# EAGLE design TestBench_rev4 (EAGLE 6.3)
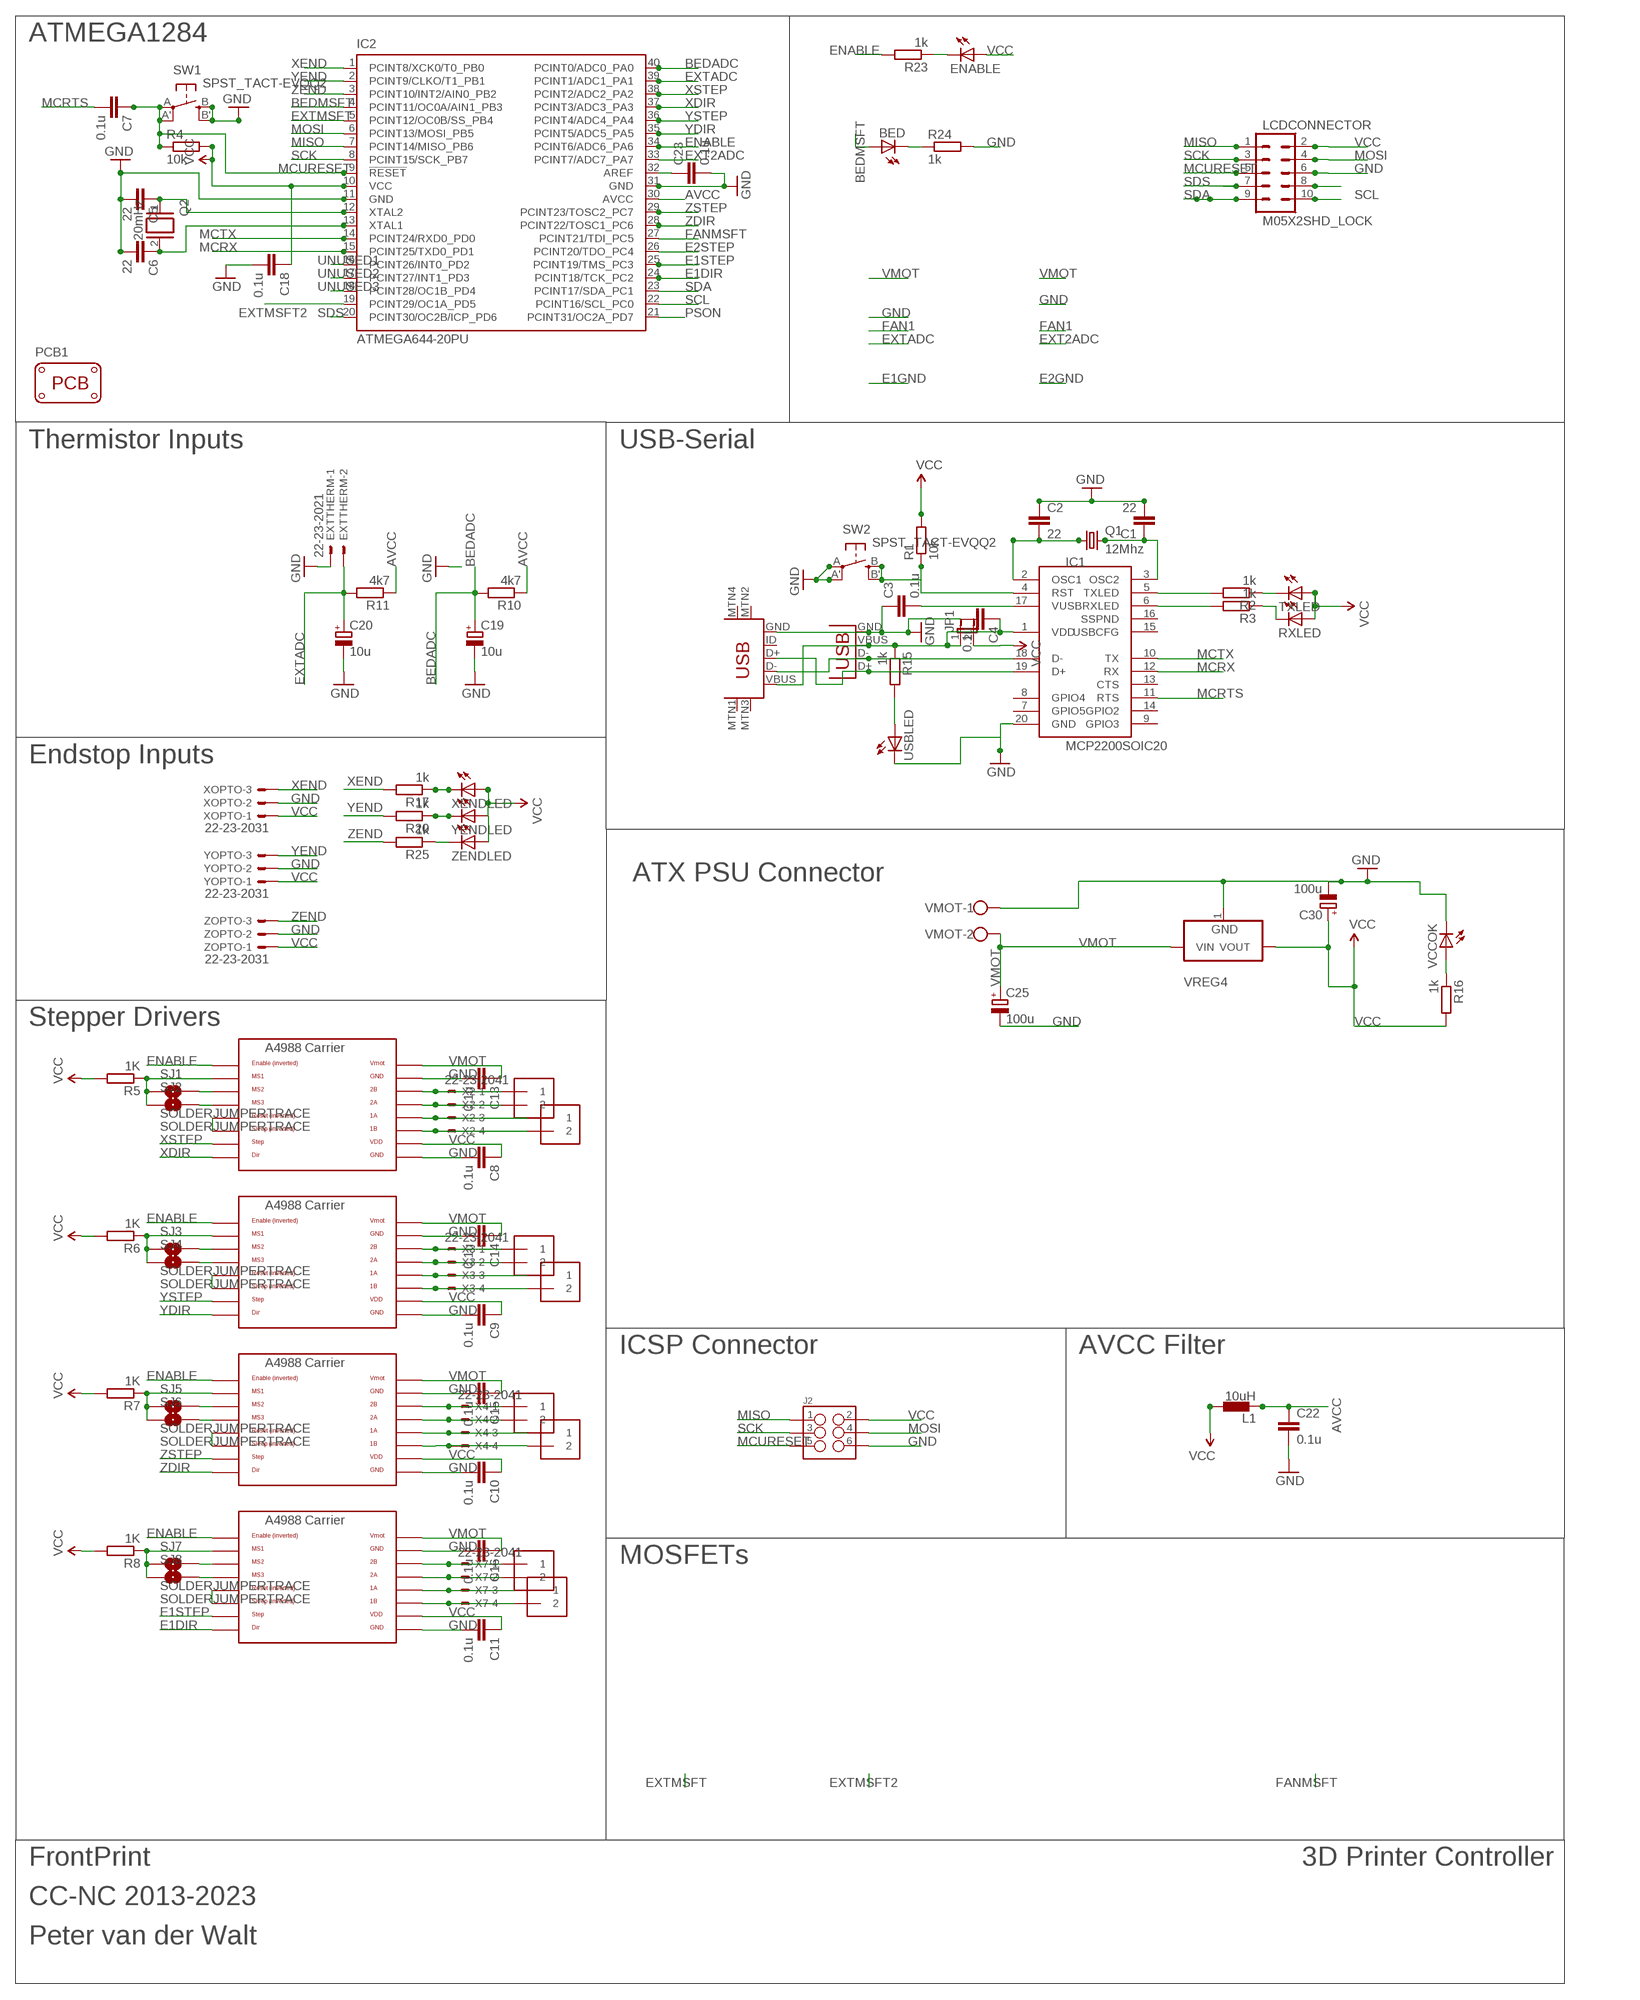
[diagram p0: schematic, sheet 1]

## Parts
BED  LEDSMT1206  [1206]
C1  22  CAP1206  [1206]
C2  22  CAP1206  [1206]
C3  0.1u  CAP1206  [1206]
C4  0.1u  CAP1206  [1206]
C5  22  CAP1206  [1206]
C6  22  CAP1206  [1206]
C7  0.1u  CAP1206  [1206]
C8  0.1u  CAP1206  [1206]
C9  0.1u  CAP1206  [1206]
C10  0.1u  CAP1206  [1206]
C11  0.1u  CAP1206  [1206]
C13  0.1u  CAP1206  [1206]
C14  0.1u  CAP1206  [1206]
C15  0.1u  CAP1206  [1206]
C16  0.1u  CAP1206  [1206]
C18  0.1u  CAP1206  [1206]
C19  10u  CPOL-EUE2.5-5  [E2,5-5]
C20  10u  CPOL-EUE2.5-5  [E2,5-5]
C22  0.1u  CAP1206  [1206]
C23  0.1u  CAP1206  [1206]
C25  100u  CPOL-EUE5-8.5  [E5-8,5]
C30  100u  CPOL-EUE5-8.5  [E5-8,5]
E1MOT1  1X2-3.5MM  [3.5MMTERM]
E1MOT2  1X2-3.5MM  [3.5MMTERM]
ENABLE  LEDSMT1206  [1206]
EPOLOLU  POLOLU_A4983CARRIER  [A4988BREAKOUT]
EXTTHERM  22-23-2021  [22-23-2021]
IC1  MCP2200SOIC20  [SOIC20]
IC2  ATMEGA644-20PU  [DIL40]
J2  M03X2  [2X3-SHROUDED]
JP1  JUMPER-2PTH_LOCK  [1X02_LOCK]
L1  10uH  BL01RN1A  [BL01RN1A]
LCDCONNECTOR  M05X2SHD_LOCK  [2X5-SHROUDED_LOCK]
PCB1  PCB_DP_SQUARE-10X10  [DP100100_V1]
Q1  12Mhz  CRYSTALHC49UP  [HC49UP]
Q2  20mHz  XTAL/S  [QS]
R1  10k  R-EU_M1206  [M1206]
R2  1k  R-EU_M1206  [M1206]
R3  1k  R-EU_M1206  [M1206]
R4  10k  R-EU_M1206  [M1206]
R5  1K  R-EU_M1206  [M1206]
R6  1K  R-EU_M1206  [M1206]
R7  1K  R-EU_M1206  [M1206]
R8  1K  R-EU_M1206  [M1206]
R10  4k7  R-EU_M1206  [M1206]
R11  4k7  R-EU_M1206  [M1206]
R15  1k  R-EU_M1206  [M1206]
R16  1k  R-EU_M1206  [M1206]
R17  1k  R-EU_M1206  [M1206]
R20  1k  R-EU_M1206  [M1206]
R23  1k  R-EU_M1206  [M1206]
R24  1k  R-EU_M1206  [M1206]
R25  1k  R-EU_M1206  [M1206]
RXLED  LEDSMT1206  [1206]
SJ1  SOLDERJUMPERTRACE  [SJ_2S-TRACE]
SJ2  SOLDERJUMPERTRACE  [SJ_2S-TRACE]
SJ3  SOLDERJUMPERTRACE  [SJ_2S-TRACE]
SJ4  SOLDERJUMPERTRACE  [SJ_2S-TRACE]
SJ5  SOLDERJUMPERTRACE  [SJ_2S-TRACE]
SJ6  SOLDERJUMPERTRACE  [SJ_2S-TRACE]
SJ7  SOLDERJUMPERTRACE  [SJ_2S-TRACE]
SJ8  SOLDERJUMPERTRACE  [SJ_2S-TRACE]
SW1  SPST_TACT-EVQQ2  [EVQ-Q2]
SW2  SPST_TACT-EVQQ2  [EVQ-Q2]
TXLED  LEDSMT1206  [1206]
U$2  USB-MINIB-5PIN  [USB-MINIB]
USBLED  LEDSMT1206  [1206]
VCCOK  LEDSMT1206  [1206]
VMOT  W237-102  [W237-102]
VREG4  VREG_3PINS-DPAK  [DPAK]
X1  USBPTH  [USB-B-PTH]
X2  22-23-2041  [22-23-2041]
X3  22-23-2041  [22-23-2041]
X4  22-23-2041  [22-23-2041]
X7  22-23-2041  [22-23-2041]
XENDLED  LEDSMT1206  [1206]
XMOT1  1X2-3.5MM  [3.5MMTERM]
XMOT2  1X2-3.5MM  [3.5MMTERM]
XOPTO  22-23-2031  [22-23-2031]
XPOLOLU  POLOLU_A4983CARRIER  [A4988BREAKOUT]
YENDLED  LEDSMT1206  [1206]
YMOT1  1X2-3.5MM  [3.5MMTERM]
YMOT2  1X2-3.5MM  [3.5MMTERM]
YOPTO  22-23-2031  [22-23-2031]
YPOLOLU  POLOLU_A4983CARRIER  [A4988BREAKOUT]
ZENDLED  LEDSMT1206  [1206]
ZMOT1  1X2-3.5MM  [3.5MMTERM]
ZMOT2  1X2-3.5MM  [3.5MMTERM]
ZOPTO  22-23-2031  [22-23-2031]
ZPOLOLU  POLOLU_A4983CARRIER  [A4988BREAKOUT]

## Nets
AVCC: C22.1 IC2.30(AVCC) L1.1 R10.1 R11.1
BEDADC: C19.+ IC2.40(PCINT0/ADC0_PA0) R10.2
BEDMSFT: BED.A IC2.4(PCINT11/OC0A/AIN1_PB3)
E1DIR: EPOLOLU.DIR IC2.24(PCINT18/TCK_PC2)
E1STEP: EPOLOLU.STEP IC2.25(PCINT19/TMS_PC3)
E2STEP: IC2.26(PCINT20/TDO_PC4)
E11A: E1MOT2.1 EPOLOLU.1A X7.3
E11B: E1MOT2.2 EPOLOLU.1B X7.4
E12A: E1MOT1.2 EPOLOLU.2A X7.2
E12B: E1MOT1.1 EPOLOLU.2B X7.1
ENABLE: EPOLOLU.EN IC2.34(PCINT6/ADC6_PA6) R23.2 XPOLOLU.EN YPOLOLU.EN ZPOLOLU.EN
EXT2ADC: IC2.33(PCINT7/ADC7_PA7)
EXTADC: C20.+ EXTTHERM.2 IC2.39(PCINT1/ADC1_PA1) R11.2
EXTMSFT: IC2.5(PCINT12/OC0B/SS_PB4)
EXTMSFT2: IC2.19(PCINT29/OC1A_PD5)
FANMSFT: IC2.27(PCINT21/TDI_PC5)
GND: C1.2 C2.1 C3.1 C4.2 C5.2 C6.2 C8.2 C9.2 C10.2 C11.2 C13.2 C14.2 C15.2 C16.2 C18.2 C19.- C20.- C22.2 C23.2 C25.- C30.- EPOLOLU.GND EPOLOLU.GND@0(GND) EXTTHERM.1 IC1.20(GND) IC2.11(GND) IC2.31(GND) J2.6 LCDCONNECTOR.6 R24.2 SW1.B'(S1) SW1.B(S) SW2.A'(P1) SW2.A(P) U$2.GND USBLED.C VCCOK.C VMOT.1 VREG4.1(GND) X1.GND XOPTO.2 XPOLOLU.GND XPOLOLU.GND@0(GND) YOPTO.2 YPOLOLU.GND YPOLOLU.GND@0(GND) ZOPTO.2 ZPOLOLU.GND ZPOLOLU.GND@0(GND)
MCRTS: C7.2 IC1.11(RTS)
MCRX: IC1.12(RX) IC2.15(PCINT25/TXD0_PD1)
MCTX: IC1.10(TX) IC2.14(PCINT24/RXD0_PD0)
MCURESET: C7.1 IC2.9(!RESET) J2.5 LCDCONNECTOR.5 R4.1 SW1.A'(P1) SW1.A(P)
MISO: IC2.7(PCINT14/MISO_PB6) J2.1 LCDCONNECTOR.1
MOSI: IC2.6(PCINT13/MOSI_PB5) J2.4 LCDCONNECTOR.4
N$1: C2.2 IC1.2(OSC1) Q1.1
N$2: C1.1 IC1.3(OSC2) Q1.2
N$3: IC1.5(TXLED) R2.2
N$4: IC1.18(D-) U$2.D- X1.D-
N$5: IC1.19(D+) U$2.D+ X1.D+
N$6: IC1.6(RXLED) R3.2
N$7: C3.2 IC1.17(VUSB)
N$9: R2.1 TXLED.C
N$10: R3.1 RXLED.C
N$11: C5.1 IC2.12(XTAL2) Q2.1
N$12: C6.1 IC2.13(XTAL1) Q2.2
N$13: IC1.4(RST) R1.1 SW2.B'(S1) SW2.B(S)
N$14: R7.1 SJ5.1 SJ6.1 ZPOLOLU.MS1
N$15: SJ6.2 ZPOLOLU.MS3
N$16: SJ5.2 ZPOLOLU.MS2
N$17: EPOLOLU.MS2 SJ7.2
N$18: EPOLOLU.MS3 SJ8.2
N$19: EPOLOLU.MS1 R8.1 SJ7.1 SJ8.1
N$20: SJ3.2 YPOLOLU.MS2
N$21: SJ4.2 YPOLOLU.MS3
N$22: R6.1 SJ3.1 SJ4.1 YPOLOLU.MS1
N$23: SJ1.2 XPOLOLU.MS2
N$24: SJ2.2 XPOLOLU.MS3
N$25: R5.1 SJ1.1 SJ2.1 XPOLOLU.MS1
N$26: XPOLOLU.RST XPOLOLU.SLP(SLEEP)
N$27: YPOLOLU.RST YPOLOLU.SLP(SLEEP)
N$28: ZPOLOLU.RST ZPOLOLU.SLP(SLEEP)
N$29: EPOLOLU.RST EPOLOLU.SLP(SLEEP)
N$34: X4.4 ZMOT2.2 ZPOLOLU.1B
N$35: X4.3 ZMOT2.1 ZPOLOLU.1A
N$36: X4.2 ZMOT1.2 ZPOLOLU.2A
N$37: X4.1 ZMOT1.1 ZPOLOLU.2B
N$38: X3.4 YMOT2.2 YPOLOLU.1B
N$39: X3.3 YMOT2.1 YPOLOLU.1A
N$40: X3.2 YMOT1.2 YPOLOLU.2A
N$41: X3.1 YMOT1.1 YPOLOLU.2B
N$42: X2.4 XMOT2.2 XPOLOLU.1B
N$43: X2.3 XMOT2.1 XPOLOLU.1A
N$44: X2.2 XMOT1.2 XPOLOLU.2A
N$45: X2.1 XMOT1.1 XPOLOLU.2B
N$54: C23.1 IC2.32(AREF)
N$57: R17.1 XENDLED.C
N$58: C4.1 IC1.1(VDD) JP1.1 R15.1 U$2.VBUS X1.VBUS
N$59: BED.C R24.1
N$60: R20.1 YENDLED.C
N$62: R25.1 ZENDLED.C
N$64: R16.1 VCCOK.A
N$68: R15.2 USBLED.A
N$71: ENABLE.C R23.1
N$73: LCDCONNECTOR.8
PSON: IC2.21(PCINT31/OC2A_PD7)
SCK: IC2.8(PCINT15/SCK_PB7) J2.3 LCDCONNECTOR.3
SCL: IC2.22(PCINT16/SCL_PC0) LCDCONNECTOR.10
SDA: IC2.23(PCINT17/SDA_PC1) LCDCONNECTOR.9
SDS: IC2.20(PCINT30/OC2B/ICP_PD6) LCDCONNECTOR.7
UNUSED1: IC2.16(PCINT26/INT0_PD2)
UNUSED2: IC2.17(PCINT27/INT1_PD3)
UNUSED3: IC2.18(PCINT28/OC1B_PD4)
VCC: C8.1 C9.1 C10.1 C11.1 C18.1 C30.+ ENABLE.A EPOLOLU.VDD IC2.10(VCC) J2.2 JP1.2 L1.2 LCDCONNECTOR.2 R1.2 R4.2 R5.2 R6.2 R7.2 R8.2 R16.2 RXLED.A TXLED.A VREG4.2(VOUT) XENDLED.A XOPTO.1 XPOLOLU.VDD YENDLED.A YOPTO.1 YPOLOLU.VDD ZENDLED.A ZOPTO.1 ZPOLOLU.VDD
VMOT: C13.1 C14.1 C15.1 C16.1 C25.+ EPOLOLU.VMOT VMOT.2 VREG4.3(VIN) XPOLOLU.VMOT YPOLOLU.VMOT ZPOLOLU.VMOT
XDIR: IC2.37(PCINT3/ADC3_PA3) XPOLOLU.DIR
XEND: IC2.1(PCINT8/XCK0/T0_PB0) R17.2 XOPTO.3
XSTEP: IC2.38(PCINT2/ADC2_PA2) XPOLOLU.STEP
YDIR: IC2.35(PCINT5/ADC5_PA5) YPOLOLU.DIR
YEND: IC2.2(PCINT9/CLKO/T1_PB1) R20.2 YOPTO.3
YSTEP: IC2.36(PCINT4/ADC4_PA4) YPOLOLU.STEP
ZDIR: IC2.28(PCINT22/TOSC1_PC6) ZPOLOLU.DIR
ZEND: IC2.3(PCINT10/INT2/AIN0_PB2) R25.2 ZOPTO.3
ZSTEP: IC2.29(PCINT23/TOSC2_PC7) ZPOLOLU.STEP
Unconnected: IC1.7(GPIO5) IC1.8(GPIO4) IC1.9(GPIO3) IC1.13(CTS) IC1.14(GPIO2) IC1.15(USBCFG) IC1.16(SSPND) U$2.ID U$2.MTN1(MTN2) U$2.MTN2(MTN3) U$2.MTN3(MTN1) U$2.MTN4

## Notes on the sheet
- ATMEGA1284
- Thermistor Inputs | USB-Serial
- Endstop Inputs
- ATX PSU Connector
- Stepper Drivers
- ICSP Connector | AVCC Filter
- MOSFETs
- FrontPrint | 3D Printer Controller
- CC-NC 2013-2023
- Peter van der Walt

## Library data of the parts
BED ENABLE RXLED TXLED USBLED VCCOK XENDLED YENDLED ZENDLED = led:LED: LED OSRAM: - CHIPLED LG R971, LG N971, LY N971, LG Q971, LY Q971, LO R971, LY R971 LH N974, LH R974 LS Q976, LO Q976, LY Q976 LO Q996 - Hyper CHIPLED LW Q18S LB Q993, LB Q99A, LB R99A - SideLED LS A670, LO A670, LY A670, LG A670, LP A670 LB A673, LV A673, LT A673, LW A673 LH A674 LY A675 LS A676, LA A676, LO A676, LY A676, LW A676 LS A679, LY A679, LG A679 - Hyper Micro SIDELED® LS Y876, LA Y876, LO Y876, LY Y876 LT Y87S - SmartLED LW L88C, LW L88S LB L89C, LB L89S, LG L890 LS L89K, LO L89K, LY L89K LS L896, LA L896, LO L896, LY L896 - TOPLED LS T670, LO T670, LY T670, LG T670, LP T670 LSG T670, LSP T670, LSY T670, LOP T670, LYG T670 LG T671, LOG T671, LSG T671 LB T673, LV T673, LT T673, LW T673 LH T674 LS T676, LA T676, LO T676, LY T676, LB T676, LH T676, LSB T676, LW T676 LB T67C, LV T67C, LT T67C, LS T67K, LO T67K, LY T67K, LW E67C LS E67B, LA E67B, LO E67B, LY E67B, LB E67C, LV E67C, LT E67C LW T67C LS T679, LY T679, LG T679 LS T770, LO T770, LY T770, LG T770, LP T770 LB T773, LV T773, LT T773, LW T773 LH T774 LS E675, LA E675, LY E675, LS T675 LS T776, LA T776, LO T776, LY T776, LB T776 LHGB T686 LT T68C, LB T68C - Hyper Mini TOPLED® LB M676 - Mini TOPLED Santana® LG M470 LS M47K, LO M47K, LY M47K Source: http://www.osram.convergy.de LUXEON: - LUMILED® LXK2-PW12-R00, LXK2-PW12-S00, LXK2-PW14-U00, LXK2-PW14-V00 LXK2-PM12-R00, LXK2-PM12-S00, LXK2-PM14-U00 LXK2-PE12-Q00, LXK2-PE12-R00, LXK2-PE12-S00, LXK2-PE14-T00, LXK2-PE14-U00 LXK2-PB12-K00, LXK2-PB12-L00, LXK2-PB12-M00, LXK2-PB14-N00, LXK2-PB14-P00, LXK2-PB14-Q00 LXK2-PR12-L00, LXK2-PR12-M00, LXK2-PR14-Q00, LXK2-PR14-R00 LXK2-PD12-Q00, LXK2-PD12-R00, LXK2-PD12-S00 LXK2-PH12-R00, LXK2-PH12-S00 LXK2-PL12-P00, LXK2-PL12-Q00, LXK2-PL12-R00 Source: www.luxeon.com KINGBRIGHT: KA-3528ASYC Source: www.kingbright.com
C1-C11 C13-C16 C18 C22 C23 = SparkFun-Passives:CAP: Capacitor Standard 0603 ceramic capacitor, and 0.1" leaded capacitor.
C19 C20 C25 C30 = rcl:CPOL-EU: POLARIZED CAPACITOR, European symbol
E1MOT1 E1MOT2 XMOT1 XMOT2 YMOT1 YMOT2 ZMOT1 ZMOT2 = adafruit:1X2: 3.5mm Terminal block http://www.ladyada.net/library/pcb/eaglelibrary.html
EPOLOLU XPOLOLU YPOLOLU ZPOLOLU = RepRapjr:POLOLU_A4983CARRIER
EXTTHERM = con-molex:22-23-2021: .100" (2.54mm) Center Header - 2 Pin; MF: MOLEX; MPN: 22-23-2021; OC_FARNELL: 1462926; OC_NEWARK: 25C3832
IC1 = microchip-update-2:MCP2200: USB 2.0 to UART Protocol Converter with GPIO
IC2 = atmel:ATMEGA644-*PU: 8-bit Microcontroller with 64K Bytes In-System Programmable Flash Auto generated by make-symbol-device-package-bsdl.ulp Rev. 34 Source: http://www.atmel.com/dyn/resources/prod_documents/doc2593.pdf; MPN: ATMEGA644-20PU; OC_FARNELL: 1288340; OC_NEWARK: 23M5060
J2 = SparkFun-Connectors:M03X2: 2x3 .1" header. Shrouded, with keying- CONN-10681 SMT- CONN-11415 Pogo pins- HW-11044; PROD_ID: CONN-10681
JP1 = SparkFun-Passives:JUMPER-2: Jumper Basic 0.1" spaced jumper. Use with breakaway headers.
L1 = inductors:BL0: Noise Suppression Products/EMI Suppression Filters, Lead EMIFIL(R) Inductor Type Source: http://www.murata.com .. BL01RN1_DS.pdf
LCDCONNECTOR = SparkFun-Connectors:M05X2: Header 5x2 Standard 10-pin dual row 0.1" header. Commonly used with AVR-ISP. Use with Spark Fun Electronics SKU: PRT-00778
PCB1 = dp_devices:PCB_DP_SQUARE: Dangerous Prototypes Standard Square PCB sizes
Q1 = adafruit:CRYSTAL: CRYSTAL; OC_FARNELL: unknown; OC_NEWARK: unknown
Q2 = special:XTAL/S: CRYSTAL
R1-R8 R10 R11 R15-R17 R20 R23-R25 = resistor:R-EU_: RESISTOR, European symbol
SJ1-SJ8 = SparkFun-Passives:SOLDERJUMPER: Solder Jumper Standard SMD solder jumper. Used to automate production. Two varients : Normally Open and Normally Closed are the same, but have different paste layers. NC will have a large amount of paste and should jumper during reflow.
SW1 SW2 = adafruit:SPST_TACT: SMT 6mm switch, EVQQ2 series http://www.ladyada.net/library/eagle
U$2 = SparkFun-Connectors:USB-MINIB: Mini-USB "B" connector with 5th pin broken out. Created new symbol breaking out 5th "ID" pin in mini/micro USB connector spec. See: http://en.wikipedia.org/wiki/Mini_usb#Cables. Uses same footprint as 4-pin symbol. Also added pins to connect to mounting / shield pads if required (probably not generally needed as signals aren't shielded once they leave the connector).
VMOT = con-wago-500:W237-102: WAGO SCREW CLAMP; MPN: 237-102; OC_FARNELL: unknown; OC_NEWARK: 70K9898
VREG4 = dp_devices:VREG_3PINS: Various 3 pin voltage regulators in different packages Double check the right pinout for the right part
X1 = SparkFun-Connectors:USB: USB Connectors USB-B-PTH is fully proven SKU : PRT-00139/CONN-08278 USB-miniB is fully proven SKU : PRT-00587 USB-A-PCB is untested. USB-A-H is throughly reviewed, but untested. Spark Fun Electronics SKU : PRT-00437 USB-B-SMT is throughly reviewed, but untested. Needs silkscreen touching up. USB-A-S has not been used/tested USB-MB-H has not been used/tested USB-MICROB has been used. CONN-09505; PROD_ID: CONN-08278; VALUE: USB-B
X2-X4 X7 = con-molex:22-23-2041: .100" (2.54mm) Center Header - 4 Pin; MF: MOLEX; MPN: 22-23-2041; OC_FARNELL: 1462920; OC_NEWARK: 38C0355
XOPTO YOPTO ZOPTO = con-molex:22-23-2031: .100" (2.54mm) Center Header - 3 Pin; MF: MOLEX; MPN: 22-23-2031; OC_FARNELL: 1462950; OC_NEWARK: 30C0862

## Board
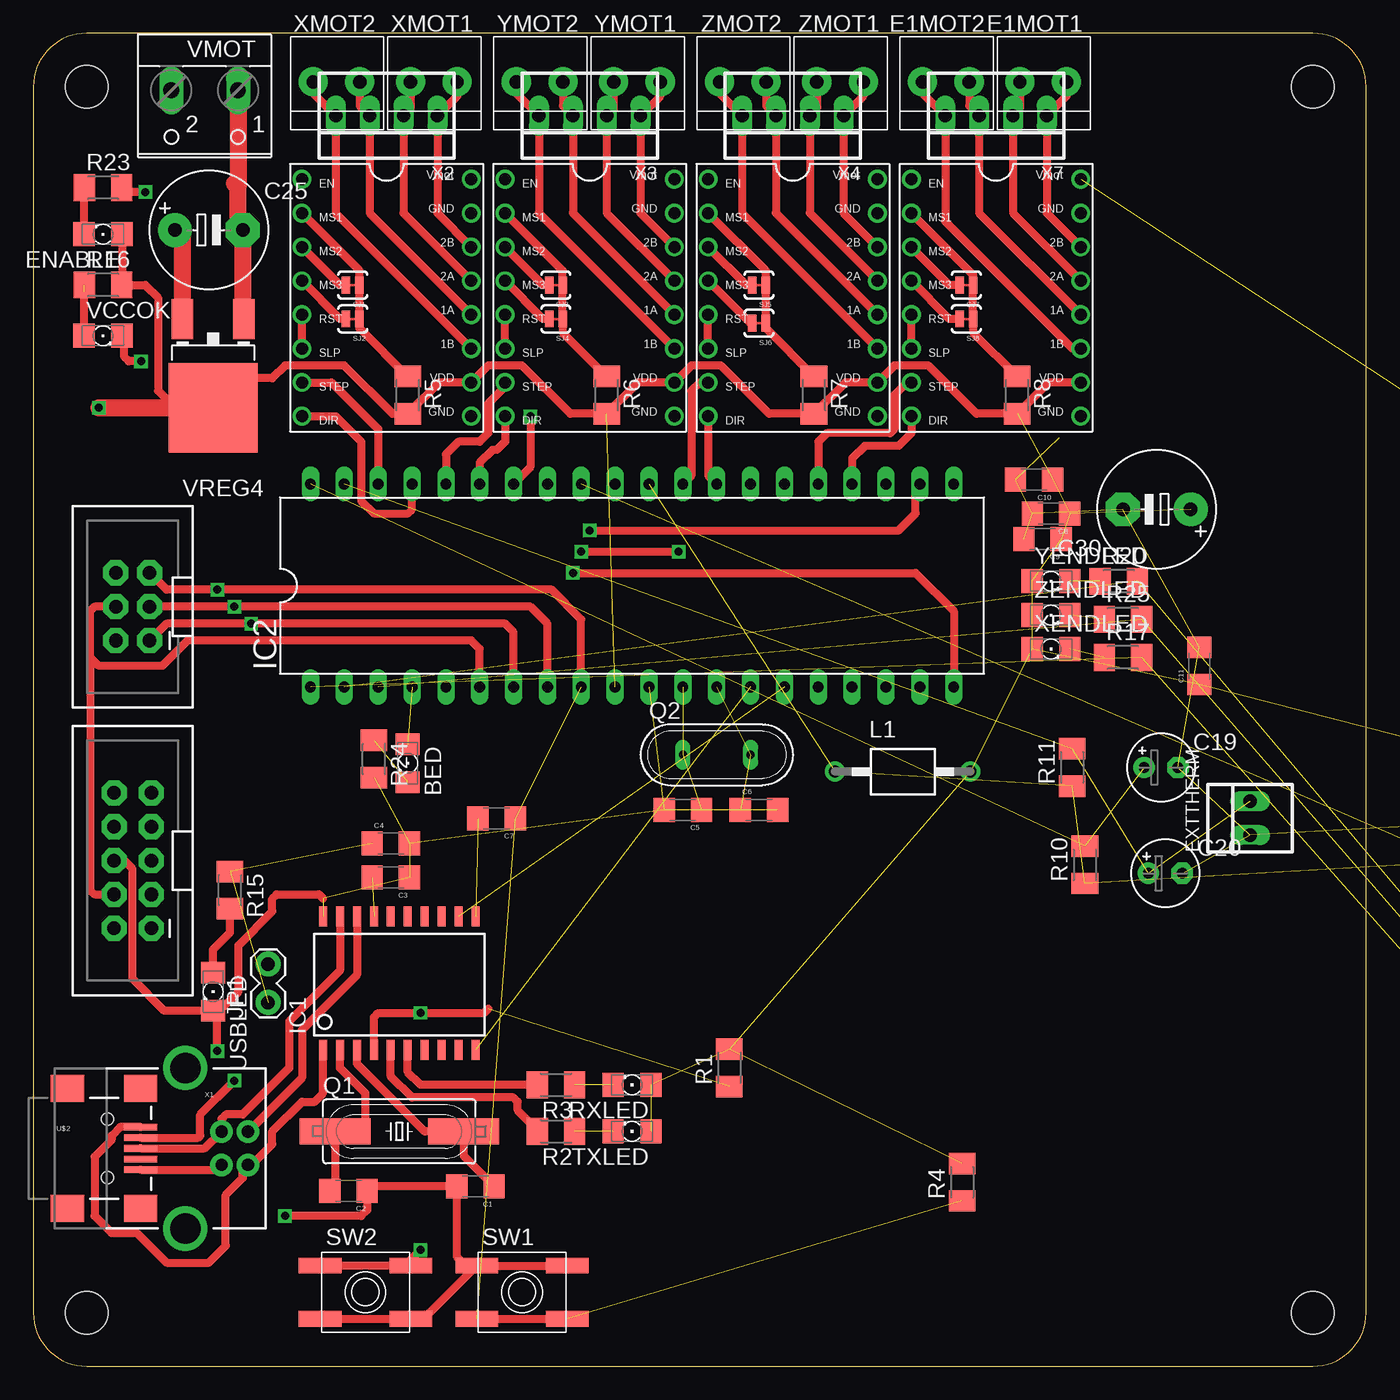
[diagram p1: board, top side]
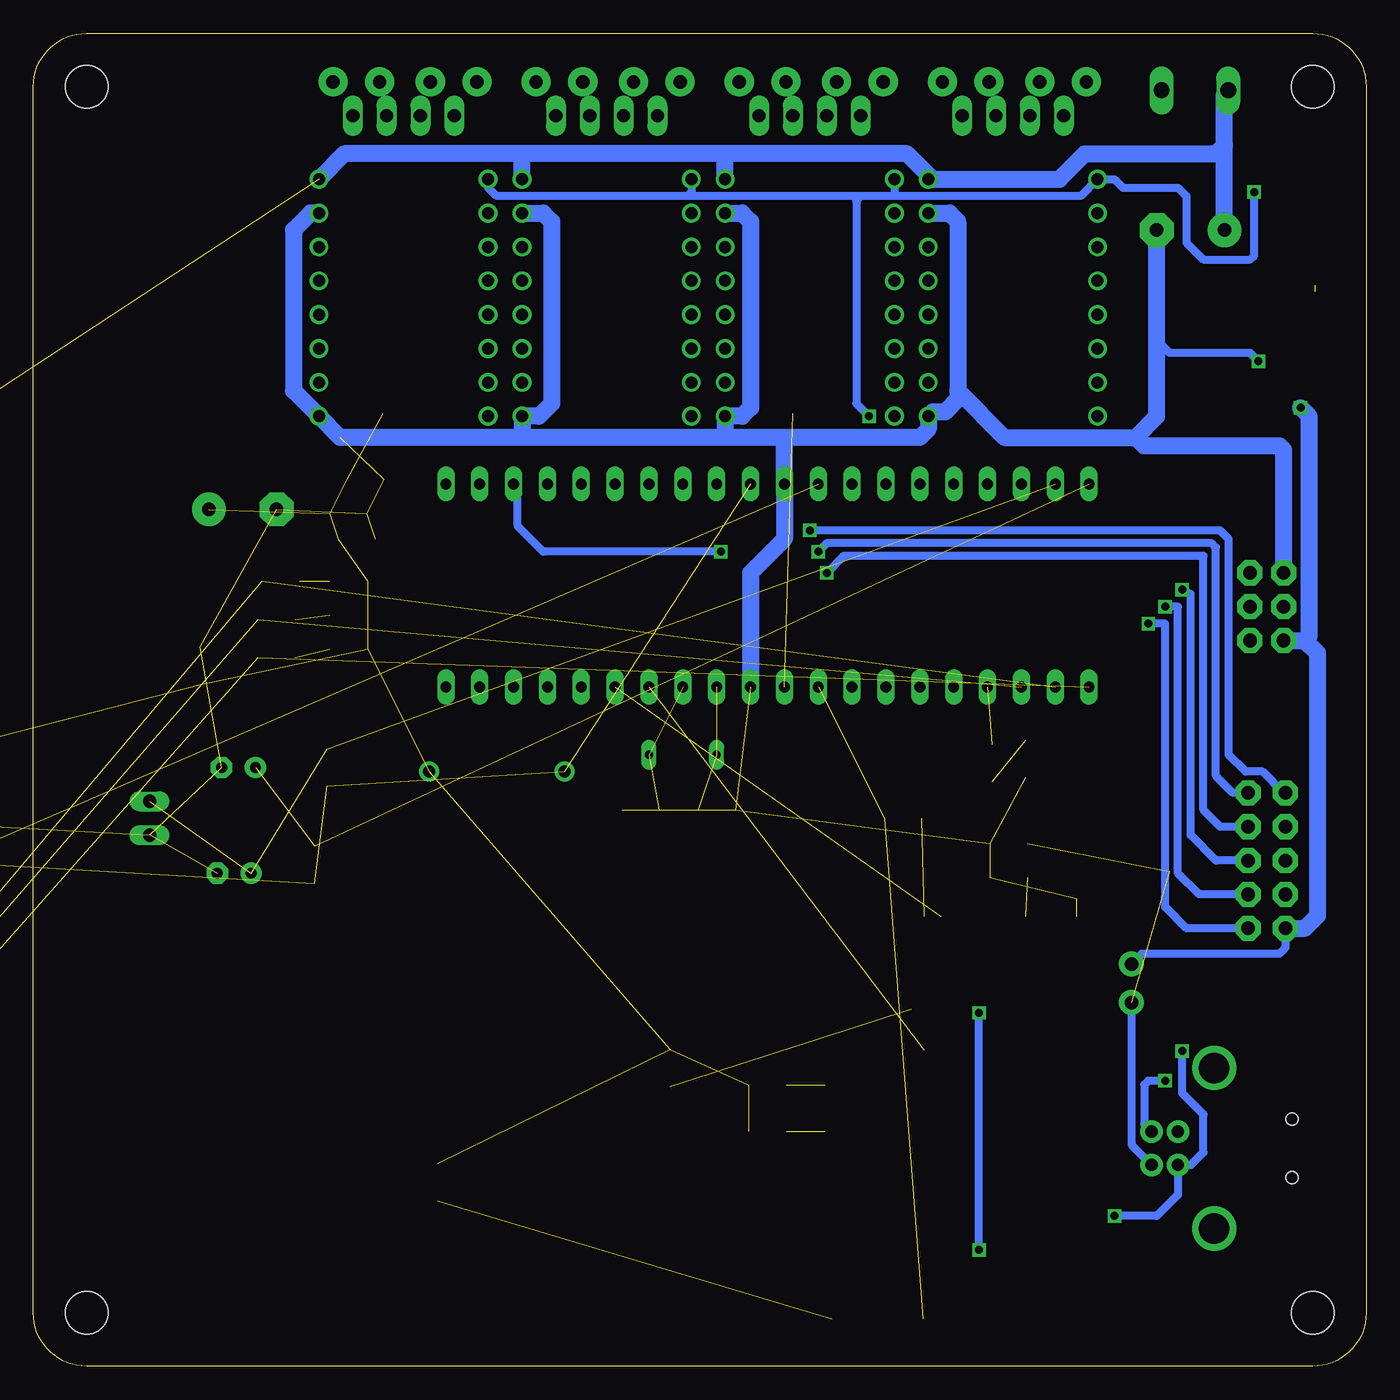
[diagram p2: board, bottom side, seen from below]

Size 100 x 100 mm. Coordinates in mm from the lower left corner, seen from the top.
Copper layers (1*16): Top 0.035mm / dielectric 1.5mm / Bottom 0.035mm
Design rules "default": minimum track width 10mil, minimum drill 24mil, track to track 8mil, track to pad 8mil, pad to pad 8mil, via to via 8mil, smd to smd 8mil, copper to edge 40mil, drill to drill 8mil, minimum pad ring 10mil, minimum via ring 8mil, stop-mask expansion 4mil, vias tented up to drill 0mil, thermal gap 10mil

### Footprints (pad centres in the part's own frame; a part is rotated, then mirrored left to right if it is on the bottom)
1206 = smd 1.6 x 1.803: A -1.422,0; C 1.422,0
1206' = smd 1.6 x 1.8: 1 -1.4,0; 2 1.4,0
E2,5-5 = drill 0.813 pad 1.6: + -1.27,0 | drill 0.813 pad 1.6 octagon: - 1.27,0
E5-8,5 = drill 1.016 pad 2.54: + -2.54,0 | drill 1.016 pad 2.54 octagon: - 2.54,0
3.5MMTERM = drill 1 pad 2.184: 1 1.8,0; 2 -1.7,0
A4988BREAKOUT = drill 0.9: 1A 8.89,1.27; 1B 11.43,1.27; 2A 6.35,1.27; 2B 3.81,1.27; DIR 16.51,-11.43; EN -1.27,-11.43; GND 16.51,1.27; GND@0 1.27,1.27; MS1 1.27,-11.43; MS2 3.81,-11.43; MS3 6.35,-11.43; RST 8.89,-11.43; SLP 11.43,-11.43; STEP 13.97,-11.43; VDD 13.97,1.27; VMOT -1.27,1.27
22-23-2021 = drill 1 long: 1 -1.27,0; 2 1.27,0
SOIC20 = smd 0.6 x 1.5: 1 -5.715,-5; 2 -4.445,-5; 3 -3.175,-5; 4 -1.905,-5; 5 -0.635,-5; 6 0.635,-5; 7 1.905,-5; 8 3.175,-5; 9 4.445,-5; 10 5.715,-5; 11 5.715,5; 12 4.445,5; 13 3.175,5; 14 1.905,5; 15 0.635,5; 16 -0.635,5; 17 -1.905,5; 18 -3.175,5; 19 -4.445,5; 20 -5.715,5
DIL40 = drill 0.813 long: 1 -24.13,-7.62; 2 -21.59,-7.62; 3 -19.05,-7.62; 4 -16.51,-7.62; 5 -13.97,-7.62; 6 -11.43,-7.62; 7 -8.89,-7.62; 8 -6.35,-7.62; 9 -3.81,-7.62; 10 -1.27,-7.62; 11 1.27,-7.62; 12 3.81,-7.62; 13 6.35,-7.62; 14 8.89,-7.62; 15 11.43,-7.62; 16 13.97,-7.62; 17 16.51,-7.62; 18 19.05,-7.62; 19 21.59,-7.62; 20 24.13,-7.62; 21 24.13,7.62; 22 21.59,7.62; 23 19.05,7.62; 24 16.51,7.62; 25 13.97,7.62; 26 11.43,7.62; 27 8.89,7.62; 28 6.35,7.62; 29 3.81,7.62; 30 1.27,7.62; 31 -1.27,7.62; 32 -3.81,7.62; 33 -6.35,7.62; 34 -8.89,7.62; 35 -11.43,7.62; 36 -13.97,7.62; 37 -16.51,7.62; 38 -19.05,7.62; 39 -21.59,7.62; 40 -24.13,7.62
2X3-SHROUDED = drill 1.016 pad 1.88 octagon: 1 -1.27,2.54; 2 1.27,2.54; 3 -1.27,0; 4 1.27,0; 5 -1.27,-2.54; 6 1.27,-2.54
1X02_LOCK = drill 1.016 pad 1.88: 1 -0.178,0; 2 2.718,0
BL01RN1A = drill 0.9 pad 1.5: 1 -5.08,0; 2 5.08,0
2X5-SHROUDED_LOCK = drill 1.016 pad 1.88 octagon: 1 -1.397,5.08; 2 1.397,5.08; 3 -1.397,2.54; 4 1.397,2.54; 5 -1.397,0; 6 1.397,0; 7 -1.397,-2.54; 8 1.397,-2.54; 9 -1.397,-5.08; 10 1.397,-5.08
DP100100_V1 = hole 3.2: -46,-46; 46,-46; 46,46; -46,46
HC49UP = smd 5.334 x 1.93: 1 -4.826,0; 2 4.826,0
QS = drill 0.61 long: 1 -2.54,0; 2 2.54,0
M1206 = smd 1.6 x 2: 1 -1.4,0; 2 1.4,0
SJ_2S-TRACE = smd 0.635 x 1.27: 1 -0.508,0; 2 0.508,0
EVQ-Q2 = smd 3.2 x 1.2: A -3.4,-2; A' 3.4,-2; B -3.4,2; B' 3.4,2
USB-MINIB = smd 2.5 x 0.5: D+ 2.5,0; D- 2.5,0.8; GND 2.5,-1.6; ID 2.5,-0.8; VBUS 2.5,1.6 | smd 2.5 x 2: MTN1 -3,4.5; MTN2 2.5,4.5; MTN3 -3,-4.5; MTN4 2.5,-4.5 | hole 0.9: 0,2.2; 0,-2.2
W237-102 = drill 1.194 long: 1 -2.5,-1.27; 2 2.5,-1.27
DPAK = smd 1.6 x 3: 1 -2.3,-6.65; 3 2.3,-6.65 | smd 6.7 x 6.7: 2 0,0
USB-B-PTH = drill 0.914 pad 1.676: D+ 0,1.25; D- 1.981,1.25; GND 0,-1.25; VBUS 1.981,-1.25 | drill 2.286: S1 -2.718,-6.02; S2 -2.718,6.02
22-23-2041 = drill 1 long: 1 -3.81,0; 2 -1.27,0; 3 1.27,0; 4 3.81,0
22-23-2031 = drill 1 long: 1 -2.54,0; 2 0,0; 3 2.54,0

### Placement (x,y rotation side)
BED  28.09,45.24 270 top
C1  22  [1206']  33.17,13.49 180 top
C2  22  [1206']  23.65,13.17 180 top
C3  0.1u  [1206']  26.82,36.67 180 top
C4  0.1u  [1206']  26.82,39.21 0 top
C5  22  [1206']  48.73,41.75 180 top
C6  22  [1206']  54.45,41.75 0 top
C7  0.1u  [1206']  34.76,41.11 180 top
C8  0.1u  [1206']  76.35,63.97 180 top
C9  0.1u  [1206']  75.72,62.07 180 top
C10  0.1u  [1206']  75.08,66.51 180 top
C11  0.1u  [1206']  87.47,52.54 90 top
C13  0.1u  [1206']  116.99,65.24 90 top  (outside the outline)
C14  0.1u  [1206']  116.99,60.16 90 top  (outside the outline)
C15  0.1u  [1206']  116.99,55.08 90 top  (outside the outline)
C16  0.1u  [1206']  116.99,50 90 top  (outside the outline)
C18  0.1u  [1206']  116.99,44.92 90 top  (outside the outline)
C19  84.61,44.92 0 top
C20  84.93,36.98 0 top
C22  0.1u  [1206']  116.99,39.84 90 top  (outside the outline)
C23  0.1u  [1206']  116.99,34.76 90 top  (outside the outline)
C25  13.17,85.24 0 top
C30  84.29,64.29 180 top
E1MOT1  75.72,96.36 0 top
E1MOT2  68.42,96.36 0 top
ENABLE  5.23,84.93 180 top
EPOLOLU  77.31,87.78 270 top
EXTTHERM  91.28,41.11 90 top
IC1  27.46,28.73 0 top
IC2  44.92,58.57 0 top
J2  7.46,56.99 180 top
JP1  17.62,27.46 90 top
L1  65.24,44.6 0 top
LCDCONNECTOR  7.46,37.94 180 top
PCB1  50,50 0 top
Q1  27.46,17.62 0 top
Q2  51.27,45.87 0 top
R1  52.22,22.38 90 top
R2  39.21,17.62 180 top
R3  39.21,21.11 180 top
R4  69.69,13.81 90 top
R5  28.09,72.86 270 top
R6  43.02,72.86 270 top
R7  58.57,72.86 270 top
R8  73.81,72.86 270 top
R10  78.89,37.62 90 top
R11  77.94,44.92 90 top
R15  14.76,35.71 270 top
R16  5.23,81.12 0 top
R17  81.75,53.18 0 top
R20  81.43,58.89 0 top
R23  5.23,88.42 0 top
R24  25.55,45.56 270 top
R25  81.75,56.03 0 top
RXLED  44.92,21.11 180 top
SJ1  23.97,81.12 180 top
SJ2  23.97,78.58 180 top
SJ3  39.21,81.12 180 top
SJ4  39.21,78.58 180 top
SJ5  54.45,81.12 180 top
SJ6  54.45,78.26 180 top
SJ7  70,81.12 180 top
SJ8  70,78.58 180 top
SW1  36.67,5.55 0 top
SW2  24.92,5.55 0 top
TXLED  44.92,17.62 180 top
U$2  5.55,16.34 0 top
USBLED  13.49,28.09 270 top
VCCOK  5.23,77.31 0 top
VMOT  12.85,94.45 180 top
VREG4  13.49,71.91 180 top
X1  14.12,16.34 0 top
X2  26.51,93.81 180 top
X3  41.75,93.81 180 top
X4  56.99,93.81 180 top
X7  72.23,93.81 180 top
XENDLED  76.35,53.81 0 top
XMOT1  30,96.36 0 top
XMOT2  22.7,96.36 0 top
XOPTO  133.82,-6.83 0 top  (outside the outline)
XPOLOLU  31.59,87.78 270 top
YENDLED  76.35,58.89 0 top
YMOT1  45.24,96.36 0 top
YMOT2  37.94,96.36 0 top
YOPTO  131.6,-1.75 0 top  (outside the outline)
YPOLOLU  46.83,87.78 270 top
ZENDLED  76.35,56.35 0 top
ZMOT1  60.48,96.36 0 top
ZMOT2  53.18,96.36 0 top
ZOPTO  134.46,-5.88 0 top  (outside the outline)
ZPOLOLU  62.07,87.78 270 top

### Tracks (layer width: path | path; a pad name or v marks a point on that pad's centre or on a via)
AVCC  (4 unrouted)
BEDADC  (2 unrouted)
BEDMSFT  (1 unrouted)
E1DIR
  Top 0.61: EPOLOLU.DIR 65.88,70 64.92,69.05 62.38,69.05 61.43,68.1 IC2.24
E1STEP
  Top 0.61: EPOLOLU.STEP 65.56,73.81 64.61,72.86 64.61,70.32 64.29,70 59.53,70 58.89,69.37 IC2.25
E11A
  Top 0.61: E1MOT2.1 70.22,94.56 X7.3 70.96,86.51 EPOLOLU.1A
E11B
  Top 0.61: E1MOT2.2 66.72,95.52 X7.4 68.42,85.88 77.94,76.35 EPOLOLU.1B
E12A
  Top 0.61: E1MOT1.2 74.02,94.34 X7.2 73.5,86.51 EPOLOLU.2A
E12B
  Top 0.61: E1MOT1.1 77.52,95.3 X7.1 76.04,86.51 EPOLOLU.2B
ENABLE  (via drill 0.6)
  Top 0.61: v37.3,71.27 37.3,67.46 IC2.34 | v8.41,88.1 6.95,88.1 R23.2
  Bottom 0.61: 35.4,87.78 21.43,87.78 XPOLOLU.EN 18.89,89.05 18.25,88.42 14.12,88.42 13.49,87.78 13.49,84.29 12.22,83.02 8.73,83.02 8.41,83.34 v8.41,88.1 | 37.94,87.78 50.95,87.78 | 50.95,87.78 65.24,87.78 65.88,88.42 EPOLOLU.EN | ZPOLOLU.EN 50.64,88.1 50.95,87.78 | YPOLOLU.EN 35.4,87.78 | 35.4,87.78 37.94,87.78 | 37.94,87.78 38.25,87.47 38.25,72.23 v37.3,71.27
EXTADC  (3 unrouted)
GND  (via drill 0.6)  (25 unrouted)
  Top 0.61: U$2.GND 13.77,14.75 X1.GND | v13.81,23.65 13.81,26.35 | 13.81,26.35 USBLED.C 9.83,26.67 7.46,29.05 7.46,37.3 6.82,37.94 LCDCONNECTOR.6 | v8.09,75.4 7.14,75.4 6.82,75.72 6.82,77.14 VCCOK.C | 13.81,26.35 13.81,26.51 15.39,28.09 15.39,31.59 17.93,34.12 17.93,35.08 18.25,35.4 21.43,35.4 21.74,35.08 | v18.89,11.27 24.6,11.27 25.05,11.71 C2.1 25.37,13.49 C1.2 31.77,8.22 32.54,7.46 33.17,7.46 SW1.B | SW2.A SW2.A' 29.27,3.55 SW1.B | SW1.B SW1.B'
  Top 1.27: VMOT.1 15.35,88.46 | VREG4.1 15.71,78.64 C25.- 15.35,85.6 15.35,88.46 | 15.35,88.46 15.08,88.74
  Bottom 0.61: v13.81,23.65 13.81,20.47 12.22,18.89 12.22,16.03 13.15,15.09 X1.GND 14.12,12.85 15.71,11.27 v18.89,11.27 | 15.71,78.64 15.71,76.99 14.76,76.04 8.73,76.04 v8.09,75.4
  Bottom 1.27: XPOLOLU.GND@0 31.27,86.51 30.63,85.88 30.63,73.18 | 30.63,73.18 30.63,72.54 31.59,71.59 32.54,71.59 XPOLOLU.GND 32.86,70.32 33.49,69.69 43.65,69.69 | 43.65,69.69 48.1,69.69 | 48.1,69.69 63.34,69.69 | 63.34,69.69 76.99,69.69 EPOLOLU.GND 80.48,73.18 80.48,85.24 79.21,86.51 EPOLOLU.GND@0 | 63.34,69.69 ZPOLOLU.GND 62.07,71.27 61.11,72.23 61.11,85.88 61.75,86.51 ZPOLOLU.GND@0 | 48.1,69.69 YPOLOLU.GND 46.83,71.27 46.19,71.91 46.19,85.88 46.83,86.51 YPOLOLU.GND@0 | 43.65,69.69 IC2.31 43.65,62.07 46.19,59.53 IC2.11 | 30.63,73.18 27.14,69.69 17.3,69.69 | 17.3,69.69 15.71,71.27 15.71,78.64 C25.- | J2.6 6.19,68.73 6.5,69.05 16.66,69.05 17.3,69.69
MCRTS  (1 unrouted)
MCRX  (1 unrouted)
MCTX  (1 unrouted)
MCURESET  (via drill 0.6)  (3 unrouted)
  Top 0.61: IC2.9 41.11,56.03 38.89,58.26 v13.81,58.26 10,58.26 J2.5 | SW1.A SW1.A'
  Bottom 0.61: LCDCONNECTOR.5 11.27,37.94 13.17,39.84 13.17,57.94 v13.81,58.26
MISO  (via drill 0.6)
  Top 0.61: IC2.7 36.03,55.08 35.4,55.72 v16.35,55.72 10,55.72 J2.1
  Bottom 0.61: LCDCONNECTOR.1 13.49,32.86 15.08,34.44 15.08,55.72 v16.35,55.72
MOSI
  Top 0.61: IC2.6 33.49,53.81 32.86,54.45 11.58,54.45 9.68,52.54 4.92,52.54 4.28,53.18 | 4.28,53.18 4.28,56.67 4.6,56.99 J2.4 | 4.28,53.18 4.28,35.71 4.6,35.4 LCDCONNECTOR.4
N$1
  Top 0.61: IC1.2 23.01,22.38 24.92,20.47 24.92,17.93 24.6,17.62 Q1.1 22.63,13.55 C2.2
N$2
  Top 0.61: IC1.3 24.28,22.7 29.36,17.62 Q1.2 32.28,15.78 C1.1
N$3
  Top 0.61: R2.2 37.81,17.75 36.35,19.2 36.35,19.84 36.03,20.16 28.41,20.16 26.82,21.74 IC1.5
N$4  (via drill 0.6)
  Top 0.61: IC1.18 24.28,29.36 20.16,25.23 20.16,21.65 X1.D- | U$2.D- 12.38,17.15 12.54,17.3 12.54,18.89 v15.08,21.43
  Bottom 0.61: v15.08,21.43 16.35,21.43 16.66,21.11 16.66,18.15 X1.D-
N$5
  Top 0.61: IC1.19 23.01,29.68 19.2,25.87 19.2,22.38 15.71,18.89 14.44,18.89 14.12,18.57 X1.D+ 12.87,16.34 U$2.D+
N$6
  Top 0.61: R3.2 29.05,21.11 28.09,22.06 IC1.6
N$7  (1 unrouted)
N$9  (1 unrouted)
N$10  (1 unrouted)
N$11  (2 unrouted)
N$12  (2 unrouted)
N$13  (via drill 0.6)  (1 unrouted)
  Top 0.61: IC1.4 25.55,26.19 25.87,26.51 v29.05,26.51 30.32,26.51 33.81,26.51 34.13,26.82 | SW2.B SW2.B' 28.32,8 v29.05,8.73
  Bottom 0.61: v29.05,8.73 v29.05,26.51
N$14
  Top 0.61: ZPOLOLU.MS1 54.95,82.19 SJ5.1 SJ6.1 54.95,77.88 R7.1
N$15
  Top 0.61: SJ6.2 53.81,78.26 ZPOLOLU.MS3
N$16
  Top 0.61: SJ5.2 53.49,81.12 ZPOLOLU.MS2
N$17
  Top 0.61: SJ7.2 68.73,81.12 EPOLOLU.MS2
N$18
  Top 0.61: SJ8.2 68.73,78.58 EPOLOLU.MS3
N$19
  Top 0.61: EPOLOLU.MS1 70.51,81.88 SJ7.1 SJ8.1 70.51,77.56 R8.1
N$20
  Top 0.61: SJ3.2 38.25,81.12 YPOLOLU.MS2
N$21
  Top 0.61: SJ4.2 38.25,78.58 YPOLOLU.MS3
N$22
  Top 0.61: YPOLOLU.MS1 39.71,82.19 SJ3.1 SJ4.1 39.71,77.56 R6.1
N$23
  Top 0.61: SJ1.2 23.01,81.12 XPOLOLU.MS2
N$24
  Top 0.61: SJ2.2 23.01,78.58 XPOLOLU.MS3
N$25
  Top 0.61: XPOLOLU.MS1 24.47,82.19 SJ1.1 SJ2.1 24.47,77.88 R5.1
N$26
  Top 0.61: XPOLOLU.SLP XPOLOLU.RST
N$27
  Top 0.61: YPOLOLU.SLP YPOLOLU.RST
N$28
  Top 0.61: ZPOLOLU.SLP ZPOLOLU.RST
N$29
  Top 0.61: EPOLOLU.SLP EPOLOLU.RST
N$34
  Top 0.61: ZMOT2.2 51.48,95.52 X4.4 53.18,86.51 ZPOLOLU.1B
N$35
  Top 0.61: ZMOT2.1 54.98,94.56 X4.3 55.72,86.51 ZPOLOLU.1A
N$36
  Top 0.61: ZMOT1.2 58.78,94.34 X4.2 58.26,86.51 ZPOLOLU.2A
N$37
  Top 0.61: ZMOT1.1 62.28,95.3 X4.1 60.8,86.51 ZPOLOLU.2B
N$38
  Top 0.61: YMOT2.2 36.24,95.52 X3.4 37.94,86.51 YPOLOLU.1B
N$39
  Top 0.61: YMOT2.1 39.74,94.56 X3.3 40.48,86.51 YPOLOLU.1A
N$40
  Top 0.61: YMOT1.2 43.54,94.34 X3.2 43.02,86.51 YPOLOLU.2A
N$41
  Top 0.61: YMOT1.1 47.04,95.3 X3.1 45.56,86.51 YPOLOLU.2B
N$42
  Top 0.61: XMOT2.2 21,95.52 X2.4 22.7,86.51 XPOLOLU.1B
N$43
  Top 0.61: XMOT2.1 24.5,94.56 X2.3 25.24,86.51 XPOLOLU.1A
N$44
  Top 0.61: XMOT1.2 28.3,94.34 X2.2 27.78,86.51 XPOLOLU.2A
N$45
  Top 0.61: XMOT1.1 31.8,95.3 X2.1 30.32,86.51 XPOLOLU.2B
N$54  (1 unrouted)
N$57  (1 unrouted)
N$58  (2 unrouted)
  Top 0.61: U$2.VBUS 6.52,17.95 5.87,17.3 5.87,16.98 4.6,15.71 4.6,11.27 5.87,10 7.77,10 10,7.77 13.17,7.77 14.44,9.04 14.44,12.85 15.71,14.12 15.71,14.7 X1.VBUS 16.37,15.09 17.93,16.66 17.93,17.62 20.16,19.84 21.11,19.84 21.74,20.47 IC1.1
  Bottom 0.61: JP1.1 17.62,16.61 X1.VBUS
N$59  (1 unrouted)
N$60  (1 unrouted)
N$62  (1 unrouted)
N$64  (1 unrouted)
  Top 0.61: VCCOK.A 3.81,80.63 3.33,81.12
N$68
  Top 0.61: USBLED.A 13.49,31.27 14.76,32.54 R15.2
N$71
  Top 0.61: ENABLE.C 3.81,88.4 R23.1
SCK  (via drill 0.6)
  Top 0.61: IC2.8 38.57,55.72 37.3,56.99 v15.08,56.99 J2.3
  Bottom 0.61: LCDCONNECTOR.3 12.54,35.4 14.12,36.98 14.12,56.99 v15.08,56.99
SCL  (via drill 0.6)
  Top 0.61: v41.75,62.7 64.92,62.7 66.19,63.97 66.19,65.88 IC2.22
  Bottom 0.61: LCDCONNECTOR.10 6.19,43.02 7.77,44.6 9.04,44.6 10.31,45.87 10.31,62.07 10.95,62.7 v41.75,62.7
SDA  (via drill 0.6)
  Top 0.61: v41.11,61.11 v48.41,61.11
  Bottom 0.61: LCDCONNECTOR.9 10,43.02 11.27,44.29 11.27,61.43 11.58,61.75 40.48,61.75 v41.11,61.11 | v48.41,61.11 61.75,61.11 63.65,63.02 63.65,65.88 IC2.23
SDS  (via drill 0.6)
  Top 0.61: v40.48,59.53 66.19,59.53 69.05,56.67 IC2.20
  Bottom 0.61: LCDCONNECTOR.7 10.95,40.48 12.22,41.75 12.22,60.8 39.21,60.8 v40.48,59.53
VCC  (via drill 0.6)  (18 unrouted)
  Top 0.61: EPOLOLU.VDD 76.17,73.81 R8.2 70.77,71.46 67.15,75.08 64.61,75.08 ZPOLOLU.VDD 60.93,73.81 R7.2 55.21,71.46 51.59,75.08 49.37,75.08 YPOLOLU.VDD 45.37,73.81 R6.2 40.29,71.46 36.67,75.08 34.13,75.08 XPOLOLU.VDD 30.45,73.81 R5.2 26.95,71.46 23.33,75.08 18.89,75.08 17.93,74.13 15.71,74.13 VREG4.2 12.22,71.91 10.63,71.91 9.36,73.18 9.36,80.16 8.41,81.12 R16.2 6.66,81.14 ENABLE.A
  Top 1.27: v4.92,71.91 12.22,71.91
  Bottom 0.61: LCDCONNECTOR.2 6.06,31.4 6.5,30.95 16.84,30.95 JP1.2
  Bottom 1.27: J2.2 4.6,54.45 | 4.6,54.45 4.28,54.76 4.28,71.27 v4.92,71.91 | LCDCONNECTOR.2 4.6,32.86 3.65,33.81 3.65,53.49 4.6,54.45
VMOT  (4 unrouted)
  Top 1.27: VREG4.3 11.19,84.69 C25.+
  Bottom 1.27: 48.41,90.96 34.44,90.96 32.86,89.37 XPOLOLU.VMOT 23.01,89.05 21.11,90.96 11.27,90.96 10.63,91.59 | 48.41,90.96 63.34,90.96 | 63.34,90.96 76.67,90.96 EPOLOLU.VMOT | ZPOLOLU.VMOT 63.34,90.96 | YPOLOLU.VMOT 48.1,90.64 48.41,90.96 | 10.63,91.59 10.63,95.44 VMOT.2 | C25.+ 10.63,91.59
XDIR
  Top 0.61: XPOLOLU.DIR 22.7,71.27 24.6,69.37 24.6,64.92 25.55,63.97 28.09,63.97 28.41,64.29 IC2.37
XEND  (2 unrouted)
XSTEP
  Top 0.61: XPOLOLU.STEP 22.38,73.81 25.87,70.32 IC2.38
YDIR
  Top 0.61: YPOLOLU.DIR 35.4,69.37 34.76,68.73 34.44,68.73 33.49,67.78 IC2.35
YEND  (2 unrouted)
YSTEP
  Top 0.61: YPOLOLU.STEP 35.4,73.5 34.13,72.23 34.13,70 33.49,69.37 31.9,69.37 30.95,68.42 IC2.36
ZDIR
  Top 0.61: ZPOLOLU.DIR 50.64,66.83 IC2.28
ZEND  (2 unrouted)
ZSTEP
  Top 0.61: ZPOLOLU.STEP 50,73.81 49.37,73.18 49.37,66.83 IC2.29